# Altium schematic sheet CONNECTORS.SchDoc
size A4
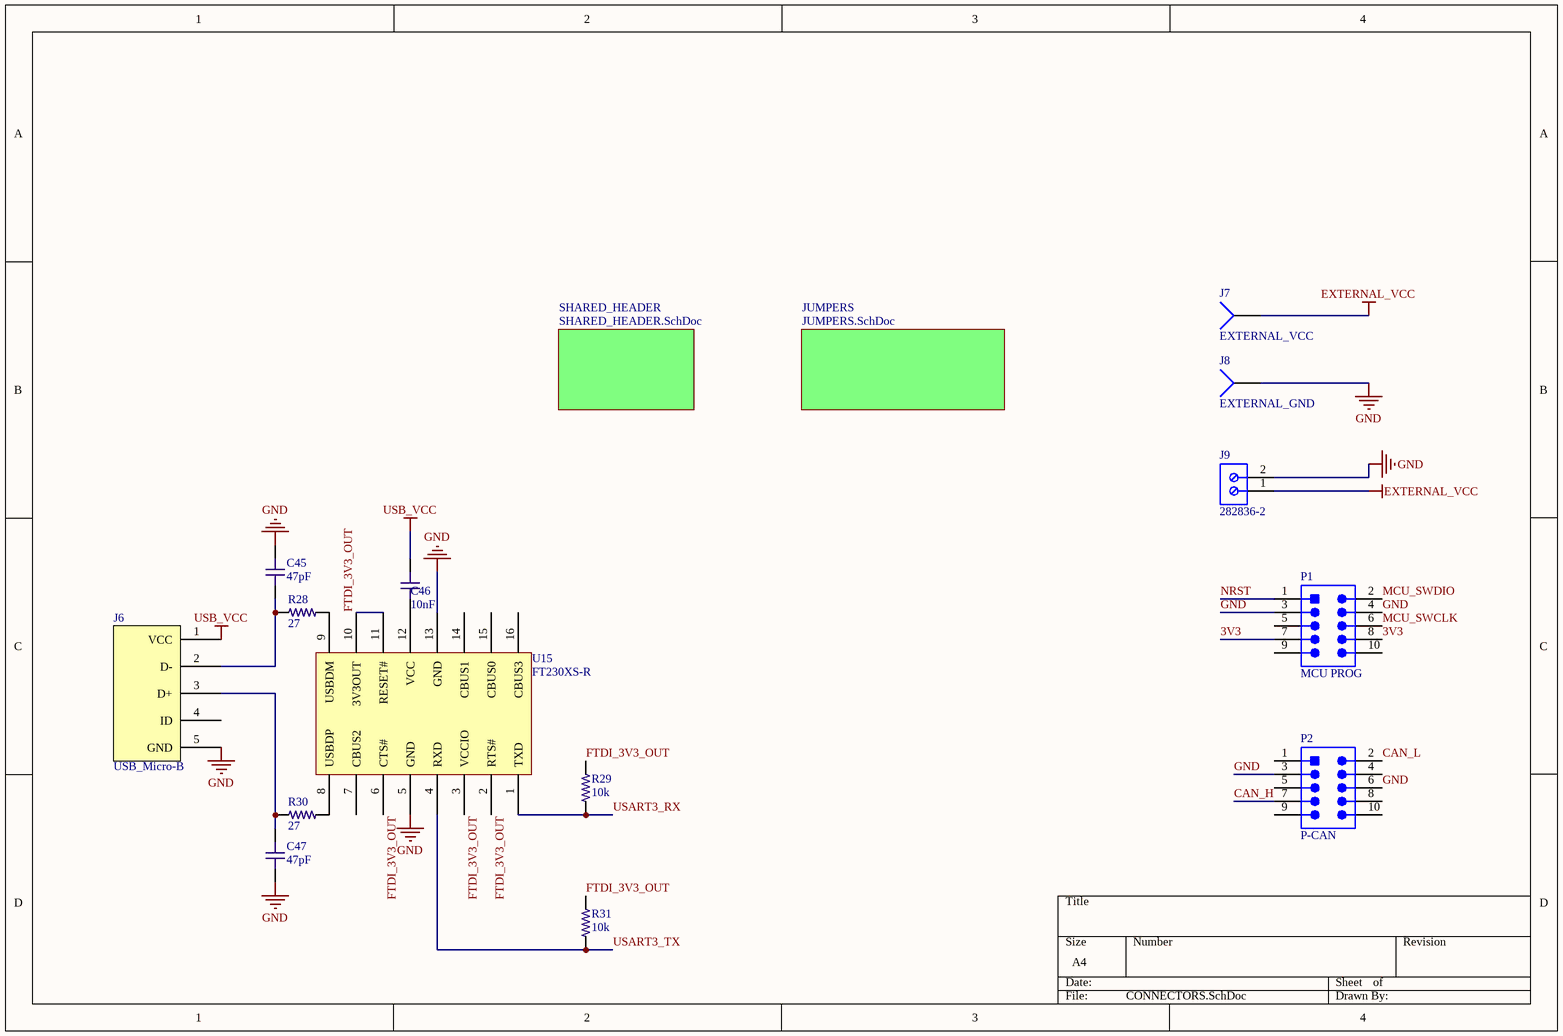
[diagram p0: CONNECTORS.SchDoc]

## Parts
C45  value 47pF  [C0603-IPC]  (hidden comment: 0603 Capacitor Template)
C46  value 10nF  [C0603-IPC]  (hidden comment: 0603 Capacitor Template)
C47  value 47pF  [C0603-IPC]  (hidden comment: 0603 Capacitor Template)
J6  USB_Micro-B  [USB_Micro-B]
J7  EXTERNAL_VCC  [Red-BananaJack]
J8  EXTERNAL_GND  [Black-BananaJack]
J9  282836-2  [TECO-282836-2_V]
P1  MCU PROG  [3M-N2510-6002-10_V]
P2  P-CAN  [3M-N2510-6002-10_V]
R28  value 27  [R0603-IPC]  (hidden comment: 0603 Template)
R29  value 10k  [R0603-IPC]  (hidden comment: 0603 Template)
R30  value 27  [R0603-IPC]  (hidden comment: 0603 Template)
R31  value 10k  [R0603-IPC]  (hidden comment: 0603 Template)
U15  FT230XS-R  [SOP64P600X175-16N]

## Sub-sheets
JUMPERS = JUMPERS.SchDoc: no entries
SHARED_HEADER = SHARED_HEADER.SchDoc: no entries

## Nets
EXTERNAL_VCC: J7.1 J9.1
GND: C45.2 C47.1 J6.5(GND) J8.1 J9.2 P1.3 P1.4 P2.3 P2.6 U15.5(GND) U15.13(GND)
USB_VCC: C46.2 J6.1(VCC)
3V3: P1.7 P1.8
CAN_H: P2.7
CAN_L: P2.2
FTDI_3V3_OUT: R29.2 R31.2 U15.2(RTS#) U15.3(VCCIO) U15.6(CTS#) U15.10(3V3OUT) U15.11(RESET#)
MCU_SWCLK: P1.6
MCU_SWDIO: P1.2
NRST: P1.1
USART3_RX: R29.1 U15.1(TXD)
USART3_TX: R31.1 U15.4(RXD)
NetC45_1: C45.1 J6.2(D-) R28.1
NetC46_1: C46.1 U15.12(VCC)
NetC47_2: C47.2 J6.3(D+) R30.1
NetR28_2: R28.2 U15.9(USBDM)
NetR30_2: R30.2 U15.8(USBDP)

Not connected (* = marked no-connect by the designer): J6 4(ID); P1 5 9 10; P2 1 4 5 8 9 10; U15 7(CBUS2) 14(CBUS1) 15(CBUS0) 16(CBUS3)

## Library data of the parts
C45-C47 = 0603 Capacitor Template: Chip Capacitor, 0603, ??nF, 10V, X7R; EIA Code: X7R; Max. Voltage: 10V
J6 = 31: USB Micro-B; OrbitPartId: 31; Manufacturer: Amphenol ICC (FCI); Part Number: 10118193-0001LF; PartId: 1; Supplier 1: Digi-Key; Supplier Part Number 1: 609-4616-1-ND; Type: Connector; Subtype: USB
J7 J8 = Socket: LatestRevisionDate: 17-Jul-2002; LatestRevisionNote: Re-released for DXP Platform.; Publisher: Altium Limited
J9 = CMP-1684-00017-1: Female Header, Pitch 5 mm, 1 x 2 Position, Height 10 mm, Tail Length 3.5 mm, Rohs, Bulk; Manufacturer: TE Connectivity; Wire Gauge: 16-30AWG; Product Training Modules: Wire-to-BoardEurostyleTerminalBlocks; Clamp Material - Plating: Brass-NickelPlated; Voltage: 300V; Mating Orientation: HorizontalwithBoard; Current: 13.5A; Pitch: 0.197"(5.00mm); Screw Thread: M3; 3D Model: 282836-2.pdf; Other Names: 5ULV-02B / A98076; Dynamic Catalog: BuchananSeries; Number of Levels: 1; Torque - Screw: 0.68Nm(6Lb-In); Featured Product: EurostyleTerminalBlockConnectors; Positions Per Level: 2; Wire Termination: Screw-RisingCageClamp; Datasheet URL: http://www.te.com.cn/commerce/DocumentDelivery/DDEController?Action=showdoc&DocId=Catalog+Section%7F1308389_EUROSTYLE_TERMINAL_BLOCKS%7F0607%7Fpdf%7FEnglish%7FENG_CS_1308389_EUROSTYLE_TERMINAL_BLOCKS_0607.pdf%7F282836-2; Color: Green; Family: TerminalBlocks-WiretoBoard; RoHS Information: 282836-2StatementofCompliance; Standard Package: 300; Contact Material - Plating: Brass-TinPlated; Manufacturer URL: http://www.te.com; Housing Material: Polyamide(PA66),Nylon6/6; Features: Interlocking(Side); Package Description: Female Header, Pitch 5 mm, 1 x 2 Position, Height 10 mm, Tail Length 3.5 mm; Mounting Type: ThroughHole; Package Reference: THD; Packaging: Bulk; Series: Buchanan; Category: Connectors,Interconnects; Screw Material - Plating: Brass-NickelPlated
P1 P2 = CMP-2000-06794-1: Male Header, Pitch 2.54 mm, 2 x 5 Postion, Height 9.91 mm, Tail Length 2.84 mm, -55 to 105 degC, RoHS, Bulk; PartNumber: N2510; Manufacturer: 3M; Package Version: Rev. M, 08/2014; Rad Hard: No; No. of Rows: 2; Number of Contacts: 10; Pitch: 2.54mm; Termination Method: Solder; Manufacturer URL: http://www.3m.com/; Package Description: 10-Pin Through Hole Device, Body 20.02 x 8.59 mm, Pitch 2.54 mm; Gender: Male; Number of Rows: 2; Orientation: Straight; Contact Plating: GoldOverNickel; Packaging: Rail/Tube; Mounting Technology: ThroughHole; Datasheet URL: https://datasheet.ciiva.com/11746/0900766b807b18da-11746957.pdf; Package Reference: N2510-6002-10; Datasheet Version: 05/2007; No. of Positions: 10; Package URL: http://multimedia.3m.com/mws/media/330367O/3mtm-100-in-4-wall-hdr-rohs-lp-straightra-hitemp-ts0770.pdf; Type: ShroudedHeader
R28-R31 = 0603 Template: Chip Resistor, 0603, ??k ohms, 0.1W
U15 = FT230XS-R: FT230XS-R USB to UART IC; OrbitPartId: 29; Manufacturer: FTDI, Future Technology Devices International Ltd; Subtype: FTDI; Part Number: FT230XS-R; PartId: 1; Supplier 1: Digi-Key; Supplier Part Number 1: 768-1135-1-ND; Type: Integrated Circuit